# EAGLE design firealarm1 (EAGLE 7.5.0)
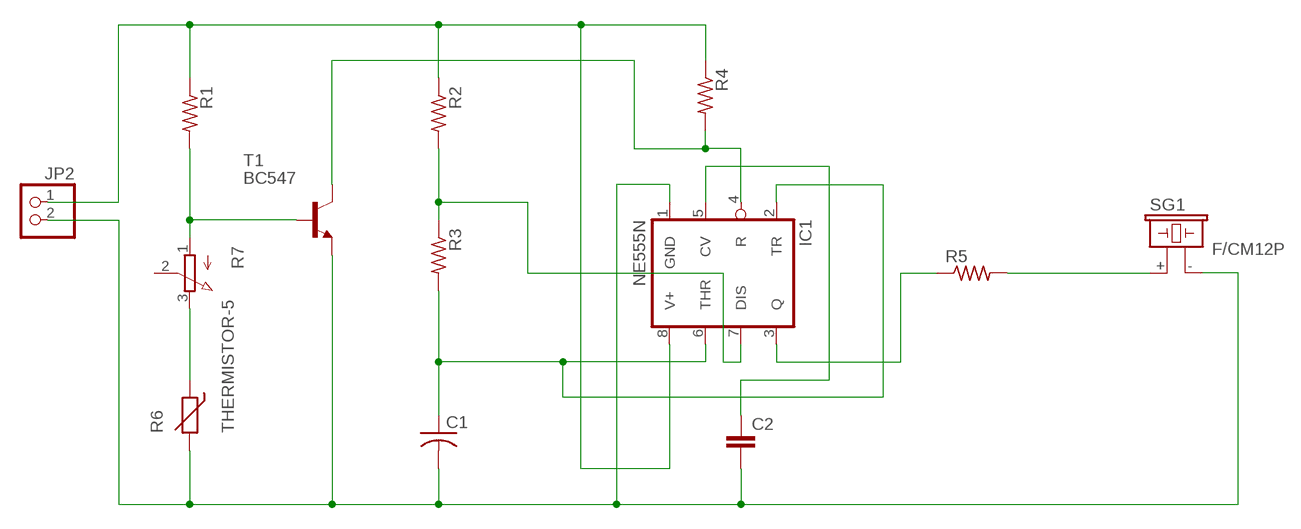
[diagram p0: schematic, sheet 1]

## Parts
C1  C-US050-025X075  [C050-025X075]
C2  C-EU025-025X050  [C025-025X050]
IC1  NE555N  [DIL08]
JP2  PINHD-1X2  [1X02]
R1  R-US_0207/10  [0207/10]
R2  R-US_0207/10  [0207/10]
R3  R-US_0207/10  [0207/10]
R4  R-US_0207/10  [0207/10]
R5  R-US_0207/10  [0207/10]
R6  THERMISTOR-5  [R-5]
R7  3RP/1610N  [3RP/1610N]
SG1  F/CM12P  [F/CM12P]
T1  BC547  [TO92]

## Nets
N$1: IC1.8(V+) JP2.1 R1.1 R2.1 R4.1
N$2: C1.2 C2.2 IC1.1(GND) JP2.2 R6.2 SG1.- T1.1(E)
N$3: C2.1 IC1.5(CV)
N$4: IC1.7(DIS) R2.2 R3.1
N$5: IC1.3(Q) R5.1
N$6: R5.2 SG1.+
N$7: C1.1 IC1.2(TR) IC1.6(THR) R3.2
N$8: IC1.4(R) R4.2 T1.3(C)
N$9: R1.2 R7.1(A) T1.2(B)
N$10: R6.1 R7.3(E)
Unconnected: R7.2(S)

## Library data of the parts
C1 = rcl:C-US: CAPACITOR, American symbol
C2 = rcl:C-EU: CAPACITOR, European symbol
IC1 = linear:*555: TIMER
JP2 = pinhead:PINHD-1X2: PIN HEADER
R1-R5 = rcl:R-US_: RESISTOR, American symbol
R6 = varistor:THERMISTOR: THERMISTOR
R7 = pot:3RP/1610N: 16mm Potentiometer one level Source: http://www.alphapotentiometers.net/html/16mm_pot_2.html
SG1 = buzzer:F/CM12P: BUZZER Source: Buerklin; OC_FARNELL: unknown; OC_NEWARK: unknown
T1 = transistor:BC547: NPN TRANSISTOR

## Board
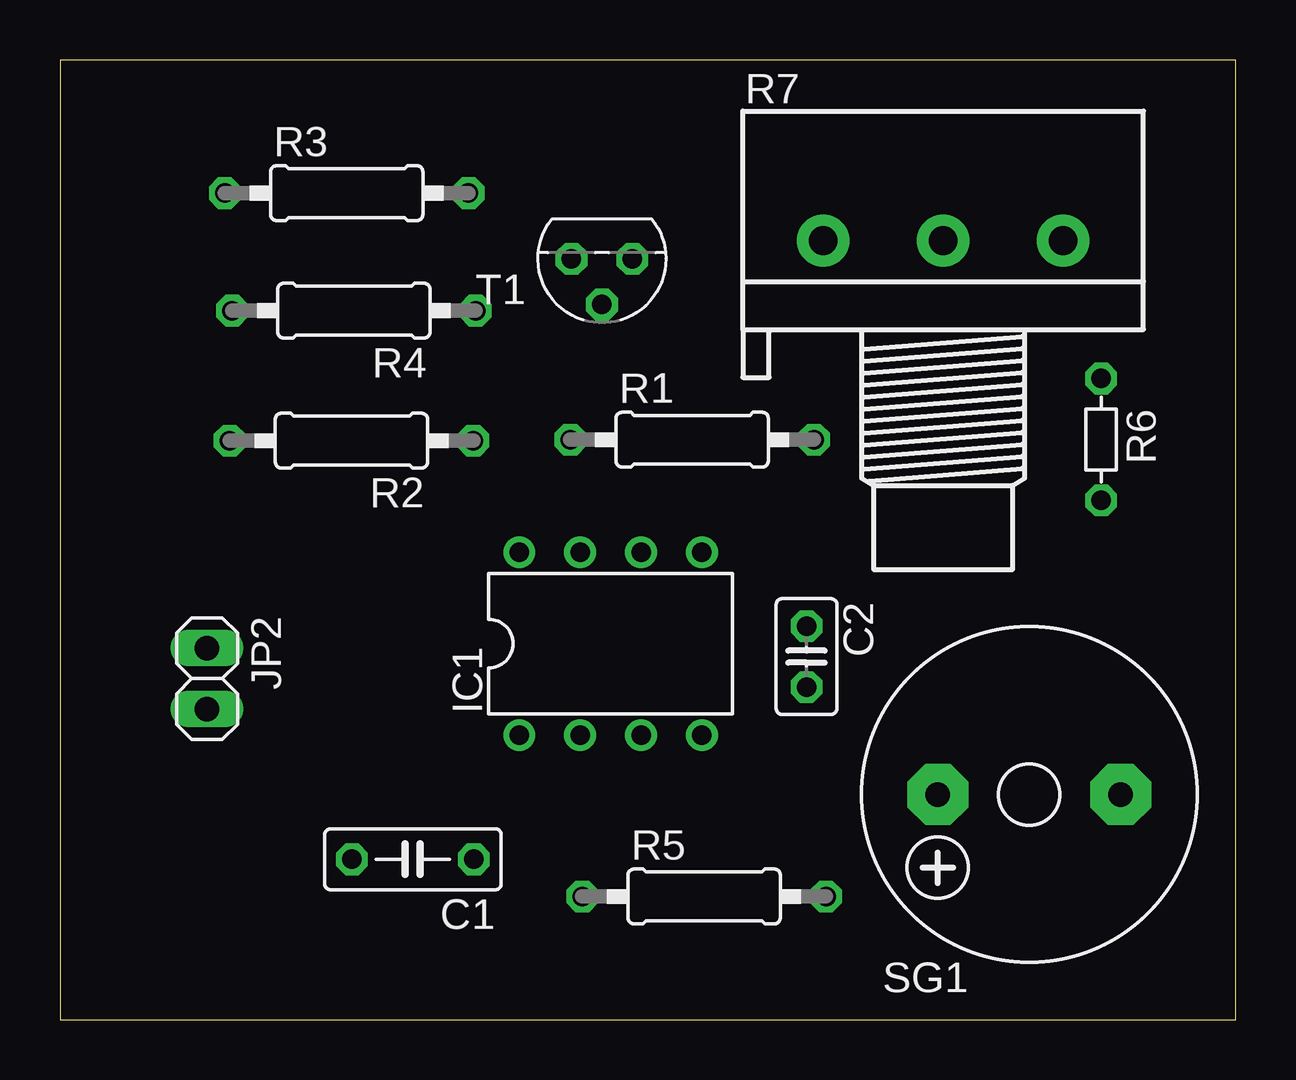
[diagram p1: board, top side]
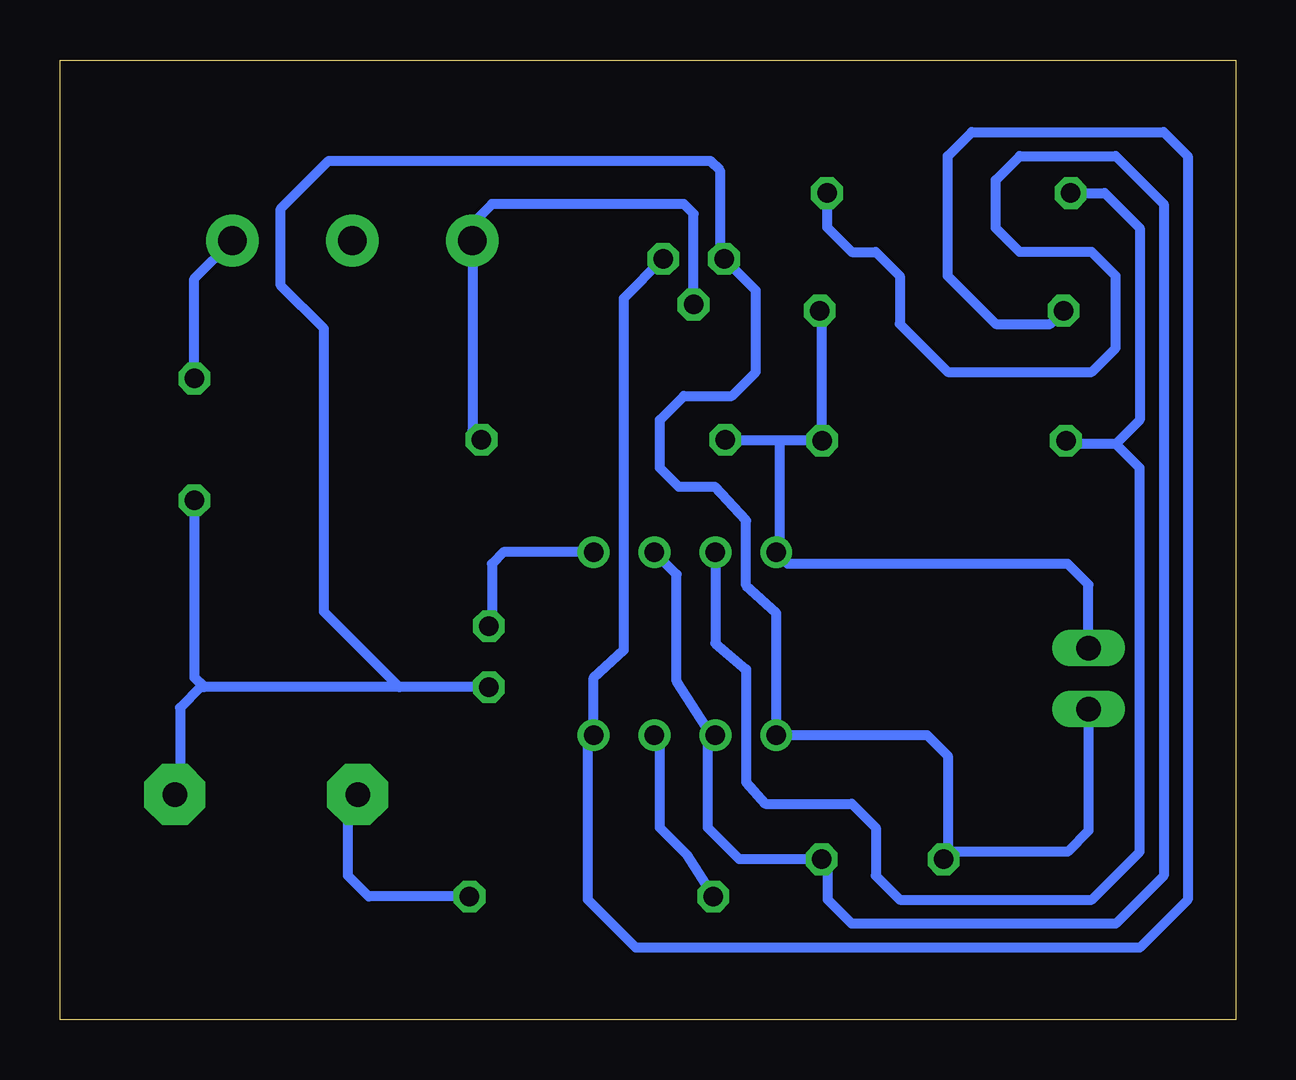
[diagram p2: board, bottom side, seen from below]

Size 49 x 40 mm. Coordinates in mm from the lower left corner, seen from the top.
Outline: 0,0 49,0 49,40 0,40 0,0
Copper layers (1*16): Top 0.035mm / dielectric 1.5mm / Bottom 0.035mm
Design rules "default": minimum track width 10mil, minimum drill 24mil, track to track 8mil, track to pad 8mil, pad to pad 8mil, via to via 8mil, smd to smd 8mil, copper to edge 40mil, drill to drill 8mil, minimum pad ring 10mil, minimum via ring 8mil, stop-mask expansion 4mil, vias tented up to drill 0mil, thermal gap 10mil

### Footprints (pad centres in the part's own frame; a part is rotated, then mirrored left to right if it is on the bottom)
C050-025X075 = drill 0.813 octagon: 1 -2.54,0; 2 2.54,0
C025-025X050 = drill 0.813 octagon: 1 -1.27,0; 2 1.27,0
DIL08 = drill 0.813 pad 1.27: 1 -3.81,-3.81; 2 -1.27,-3.81; 3 1.27,-3.81; 4 3.81,-3.81; 5 3.81,3.81; 6 1.27,3.81; 7 -1.27,3.81; 8 -3.81,3.81
1X02 = drill 1.016 long: 1 -1.27,0; 2 1.27,0
0207/10 = drill 0.813 octagon: 1 -5.08,0; 2 5.08,0
R-5 = drill 0.813 octagon: 1 -2.54,0; 2 2.54,0
3RP/1610N = drill 1.2 pad 2.184: 1 -5,0; 2 0,0; 3 5,0
F/CM12P = drill 1.016 pad 2.54 octagon: + 3.81,0; - -3.81,0
TO92 = drill 0.813 octagon: 1 1.27,0; 2 0,1.905; 3 -1.27,0

### Placement (x,y rotation side)
C1  14.71,6.68 180 top
C2  31.12,15.13 270 top
IC1  22.95,15.67 0 top
JP2  6.13,14.21 270 top
R1  26.35,24.17 0 top
R2  12.15,24.13 180 top
R3  11.95,34.45 0 top
R4  12.25,29.55 180 top
R5  26.85,5.13 0 top
R6  43.4,24.18 270 top
R7  36.81,32.47 0 top
SG1  40.4,9.38 180 top
T1  22.59,31.71 180 top

### Tracks (layer width: path | path; a pad name or v marks a point on that pad's centre or on a via)
N$1
  Bottom 0.406: JP2.1 6.13,18.13 7,19 18.66,19 IC1.8 19,19.48 19,24.13 | R2.1 17.23,29.45 R4.1 | R2.1 17.23,23.77 | R2.1 19,24.13 | 19,24.13 21.27,24.13 R1.1
N$2
  Bottom 0.406: JP2.2 6.13,7.87 7,7 11.85,7 C1.2 12,6.85 12,11 12.86,11.86 IC1.1 19.14,16.94 20.4,18.1 20.4,20.8 21.7,22.2 23.2,22.2 24,23 24,25 23,26 21,26 20,27 20,30.39 T1.1 21.5,31.89 21.5,35.4 21.9,35.8 37.8,35.8 39.8,33.8 39.8,30.6 38,28.8 38,17 34.86,13.86 C2.2 43,13.86 | 43,13.86 43.14,13.86 44,13 44,9.59 SG1.- | R6.2 43.4,14.26 43,13.86
N$3
  Bottom 0.406: IC1.5 30.52,19.48 31,19 31,16.52 C2.1
N$4
  Bottom 0.406: R3.1 5.45,34.45 4,33 4,25 5,24 | 5,24 6.94,24 R2.2 | IC1.7 21.68,15.68 20.4,14.6 20.4,9.9 19.6,9 16,9 15,8 15,6 14,5 6,5 4,7 4,23 5,24
N$5
  Bottom 0.406: R5.1 22.87,6.87 24,8 24,11.64 IC1.3
N$6
  Bottom 0.406: R5.2 36.13,5.13 37,6 37,8.97 SG1.+
N$7
  Bottom 0.406: IC1.6 23.3,18.56 23.3,14.1 21.86,11.86 IC1.2 22,11.54 22,8 20.68,6.68 C1.1 17,6.43 17,5 16,4 5,4 3,6 3,34 5,36 9,36 10,35 10,33 9,32 6,32 5,31 5,28 6,27 12,27 14,29 14,31 15,32 16,32 17.03,33.03 R3.2
N$8
  Bottom 0.406: R4.2 7.72,29 10,29 12,31 12,36 11,37 3,37 2,36 2,5 4,3 25,3 27,5 27,11.62 IC1.4 26.76,14.24 25.5,15.4 25.5,30.07 T1.3
N$9
  Bottom 0.406: T1.2 22.59,33.59 23,34 31,34 32,33 32,32.66 R7.1 31.81,24.55 R1.2
N$10
  Bottom 0.406: R6.1 43.4,30.88 R7.3